# Altium project FoxSky.Tractor2000.PrjPcb
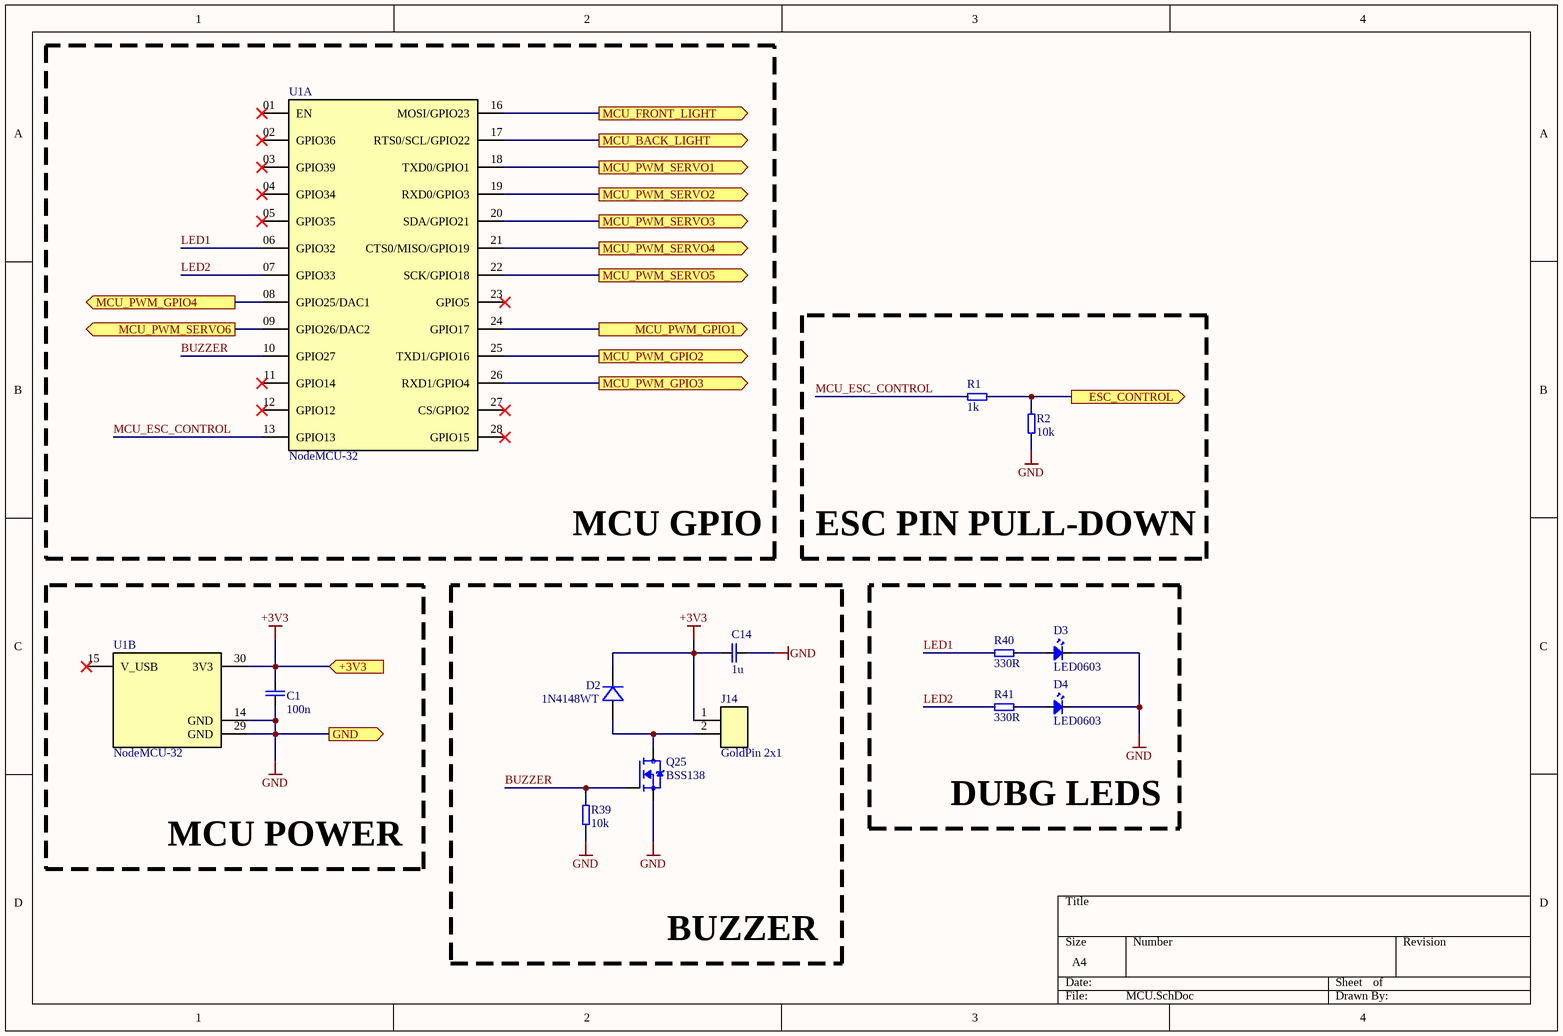
[diagram p0: MCU.SchDoc]
2 sheets, 73 parts. Net scope: flat (ports and power ports of the same name join across sheets).
Board file: FoxSky.TractorVCU.PcbDoc
Sheets:
  MCU.SchDoc
  LOAD_SWITCHES.SchDoc

## Sheet MCU.SchDoc
size A4; SheetNumber: 2; SheetTotal: 4

### Parts
C1  100n  [C0402]
C14  1u  [C0603]
D2  1N4148WT  [SMBJSeries_LTF]
D3  LED0603  [LED0603]
D4  LED0603  [LED0603]
J14  GoldPin 2x1  [HARWIN_M20-9990246]
Q25  BSS138  [SOT95P240X111-3N]
R1  1k  [R0402]
R2  10k  [R0402]
R39  10k  [R0603]
R40  330R  [R0603]
R41  330R  [R0603]
U1  NodeMCU-32  [NodeMCU-32]  (parts A,B of 2)

### Blocks framed on the sheet
MCU GPIO: U1
ESC PIN PULL-DOWN: R1 R2
MCU POWER: C1 U1
BUZZER: C14 D2 J14 Q25 R39
DUBG LEDS: D3 D4 R40 R41

### Ports
+3V3 (in, see Tractor2000[4B], POWER[4A]), ESC_CONTROL (out, see Tractor2000[4C]), GND (out, see Tractor2000[4C], LOAD_SWITCHES[2A], POWER[1A]), MCU_BACK_LIGHT (out, see Tractor2000[4B], LOAD_SWITCHES[1B]), MCU_FRONT_LIGHT (out, see Tractor2000[4B], LOAD_SWITCHES[1A]), MCU_PWM_GPIO1 (out, see Tractor2000[4B], LOAD_SWITCHES[3A]), MCU_PWM_GPIO2 (out, see Tractor2000[4B], LOAD_SWITCHES[3B]), MCU_PWM_GPIO3 (out, see Tractor2000[4B], LOAD_SWITCHES[5A]), MCU_PWM_GPIO4 (out, see Tractor2000[4B], LOAD_SWITCHES[5B]), MCU_PWM_SERVO1 (out, see Tractor2000[4B], LOAD_SWITCHES[1C]), MCU_PWM_SERVO2 (out, see Tractor2000[4B], LOAD_SWITCHES[1D]), MCU_PWM_SERVO3 (out, see Tractor2000[4B], LOAD_SWITCHES[3C]), MCU_PWM_SERVO4 (out, see Tractor2000[4B], LOAD_SWITCHES[3D]), MCU_PWM_SERVO5 (out, see Tractor2000[4B], LOAD_SWITCHES[5C]), MCU_PWM_SERVO6 (out, see Tractor2000[4B], LOAD_SWITCHES[5D])

### Nets
+3V3: C1.2 C14.2 D2.1 J14.1 U1.30(3V3) ; port +3V3
GND: C1.1 C14.1 D3.K D4.K Q25.2(S) R2.1 R39.1 U1.14(GND) U1.29(GND) ; port GND
BUZZER: Q25.1(G) R39.2 U1.10(GPIO27)
LED1: R40.2 U1.06(GPIO32)
LED2: R41.2 U1.07(GPIO33)
MCU_ESC_CONTROL: R1.1 U1.13(GPIO13)
NetD2_2: D2.2 J14.2 Q25.3(D)
NetD3_A: D3.A R40.1
NetD4_A: D4.A R41.1
NetQ4_1: U1.16(MOSI/GPIO23) ; port MCU_FRONT_LIGHT
NetQ5_1: U1.24(GPIO17) ; port MCU_PWM_GPIO1
NetQ6_1: U1.26(RXD1/GPIO4) ; port MCU_PWM_GPIO3
NetQ10_1: U1.17(RTS0/SCL/GPIO22) ; port MCU_BACK_LIGHT
NetQ11_1: U1.25(TXD1/GPIO16) ; port MCU_PWM_GPIO2
NetQ12_1: U1.08(GPIO25/DAC1) ; port MCU_PWM_GPIO4
NetQ16_1: U1.18(TXD0/GPIO1) ; port MCU_PWM_SERVO1
NetQ17_1: U1.20(SDA/GPIO21) ; port MCU_PWM_SERVO3
NetQ18_1: U1.22(SCK/GPIO18) ; port MCU_PWM_SERVO5
NetQ22_1: U1.19(RXD0/GPIO3) ; port MCU_PWM_SERVO2
NetQ23_1: U1.21(CTS0/MISO/GPIO19) ; port MCU_PWM_SERVO4
NetQ24_1: U1.09(GPIO26/DAC2) ; port MCU_PWM_SERVO6
NetR1_2: R1.2 R2.2 ; port ESC_CONTROL

Not connected (* = marked no-connect by the designer): U1 01(EN)* 02(GPIO36)* 03(GPIO39)* 04(GPIO34)* 05(GPIO35)* 11(GPIO14)* 12(GPIO12)* 15(V_USB)* 23(GPIO5)* 27(CS/GPIO2)* 28(GPIO15)*

### Library data of the parts
C1 = CMP-00023-15: Generic SMD 0402 Ceramic Capacitor
C14 = CMP-00024-8: Generic 0603 SMD Ceramic Capacitor
D2 = 1N4148WT: Description; Manufacturer_Name: Littelfuse Inc; Manufacturer_Part_Number: SMBJ7.0A; Copyright: Copyright (C) 2025 Ultra Librarian. All rights reserved.
D3 D4 = CMP-00036-7: 0603 LED
J14 = GoldPin 2x1: 2.54mm (0.1) Pitch SIL Vertical Throughboard Pin Header, 6.1mm mating pin height, tin, 2 contacts; MF: Harwin; MP: M20-9990246; SnapEDA_Link: https://www.snapeda.com/parts/M20-9990246/Harwin/view-part/?ref=snap; Package: None; Value: *; Check_prices: https://www.snapeda.com/parts/M20-9990246/Harwin/view-part/?ref=eda
Q25 = BSS138: N-Channel 50 V 220mA (Ta) 350mW (Ta) Surface Mount SOT-23-3; MF: onsemi; SnapEDA_Link: https://www.snapeda.com/parts/BSS138/Onsemi/view-part/?ref=snap; Package: SOT-23-3 ON Semiconductor; Value: *; MP: BSS138; Check_prices: https://www.snapeda.com/parts/BSS138/Onsemi/view-part/?ref=eda
R1 R2 = CMP-00016-11: Generic 0402 SMD Resistor
R39-R41 = CMP-00017-10: Generic 0603 SMD Resistor
U1 = NodeMCU-32: MF: Samtec Inc.; MP: TS-115-T-A; Package: None; Price: None; Value: *; Availability: Unavailable

## Sheet LOAD_SWITCHES.SchDoc
size A3; SheetNumber: 3; SheetTotal: 4
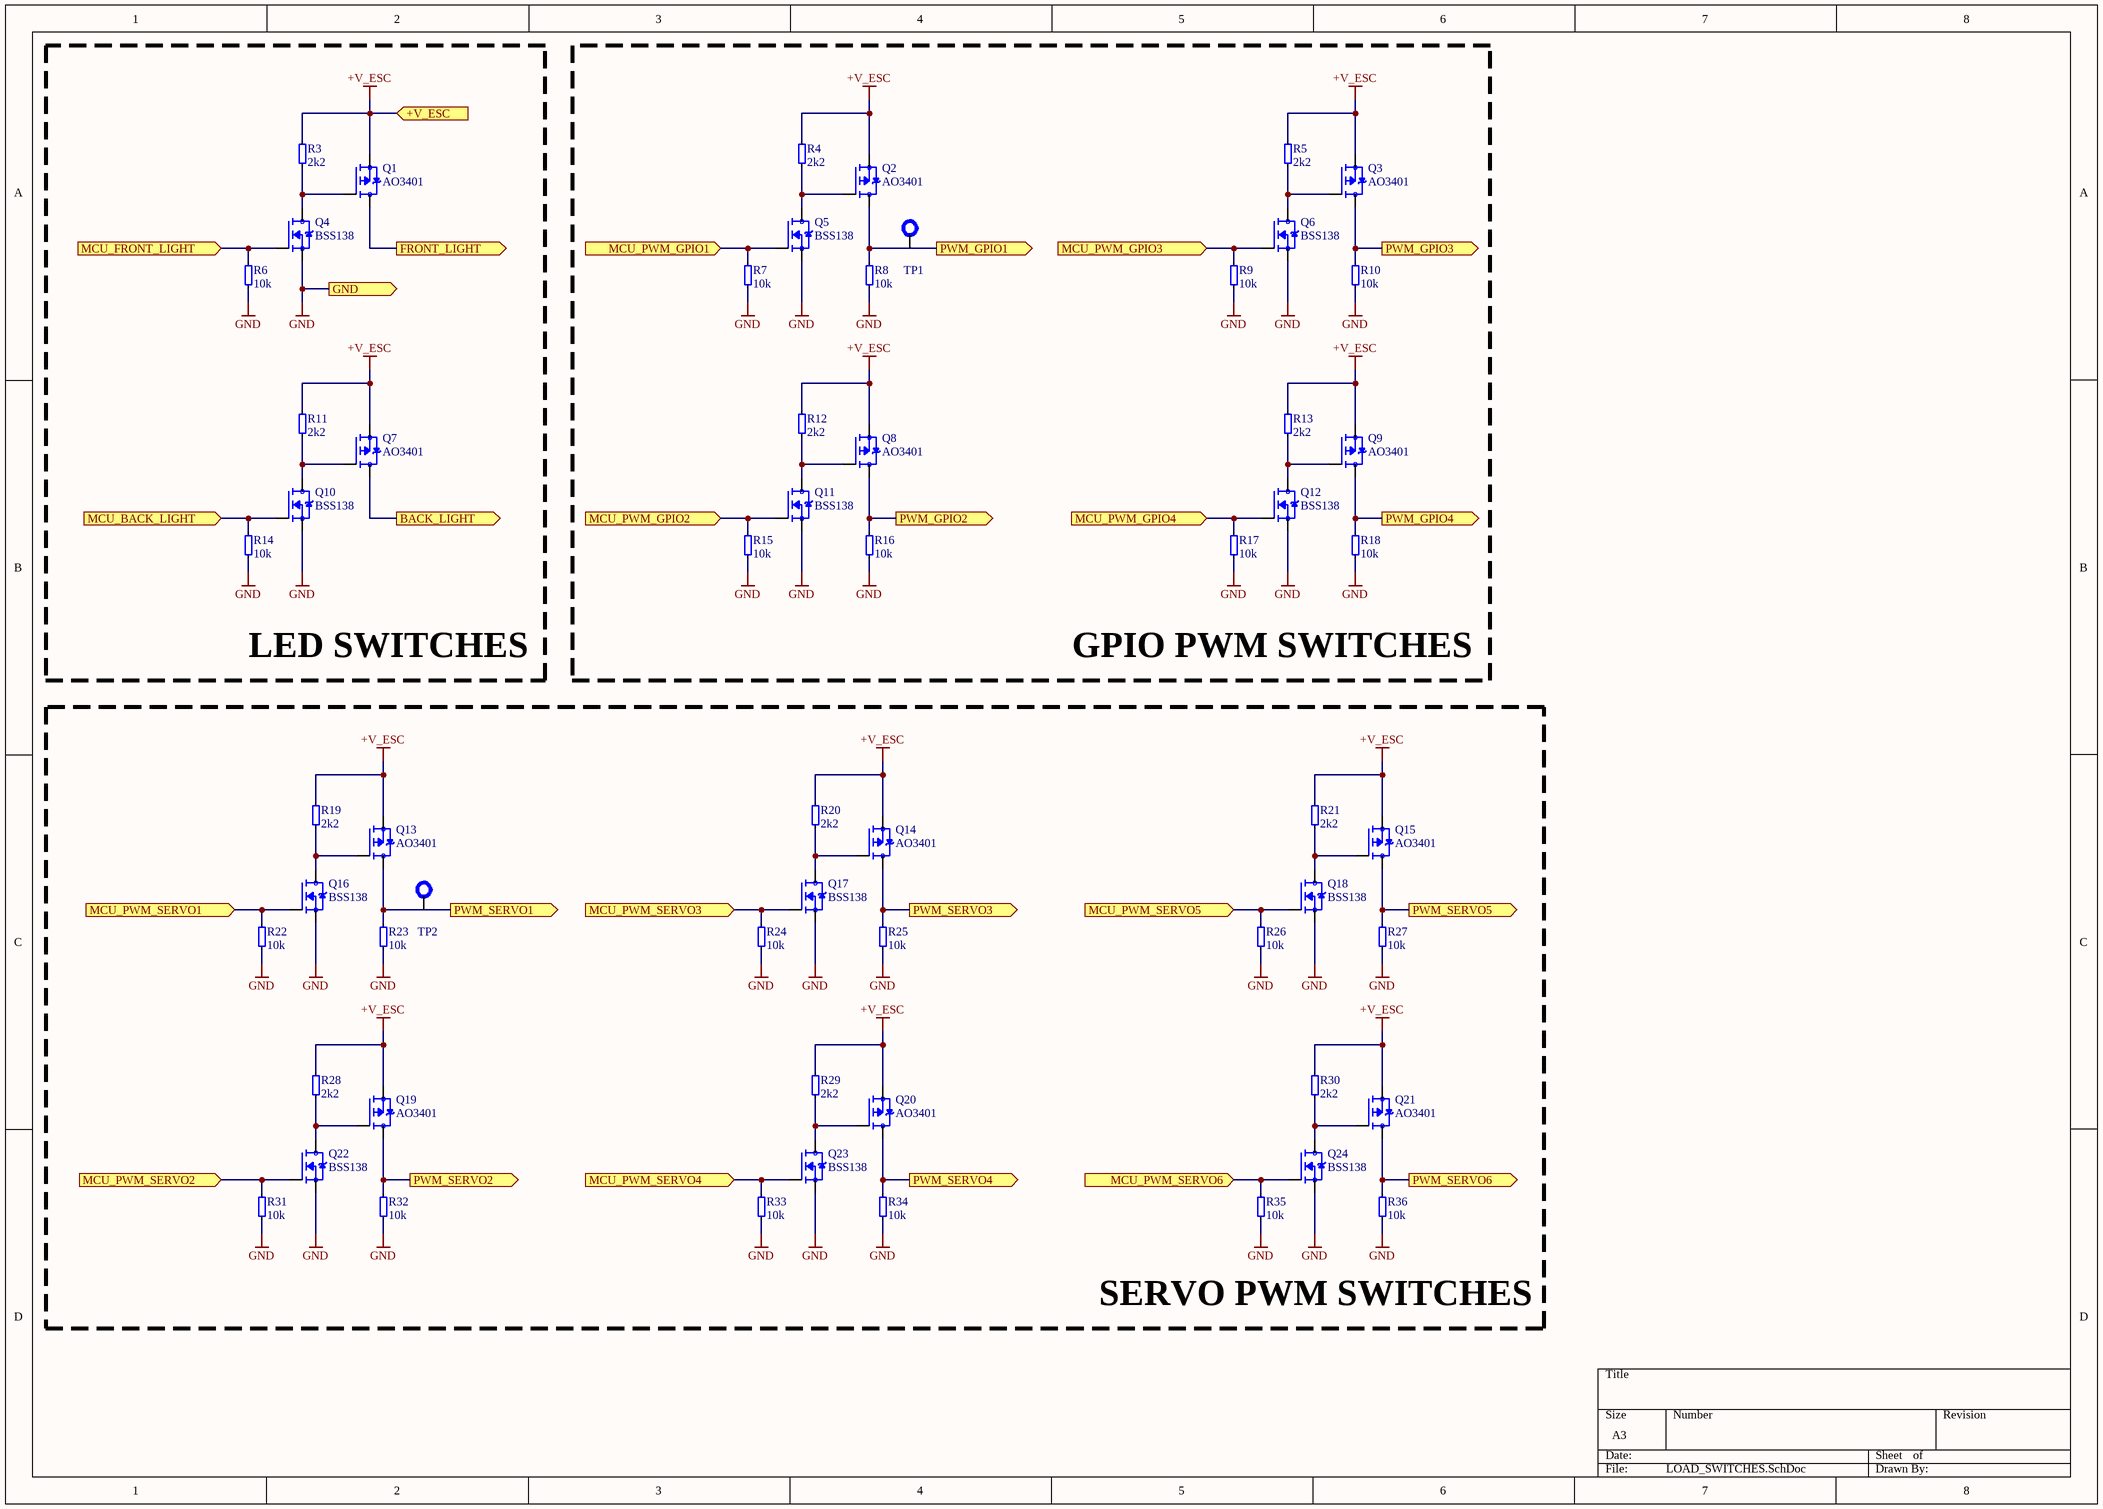
[diagram p1: LOAD_SWITCHES.SchDoc]

### Parts
Q1  AO3401  [SOT95P240X111-3N]
Q2  AO3401  [SOT95P240X111-3N]
Q3  AO3401  [SOT95P240X111-3N]
Q4  BSS138  [SOT95P240X111-3N]
Q5  BSS138  [SOT95P240X111-3N]
Q6  BSS138  [SOT95P240X111-3N]
Q7  AO3401  [SOT95P240X111-3N]
Q8  AO3401  [SOT95P240X111-3N]
Q9  AO3401  [SOT95P240X111-3N]
Q10  BSS138  [SOT95P240X111-3N]
Q11  BSS138  [SOT95P240X111-3N]
Q12  BSS138  [SOT95P240X111-3N]
Q13  AO3401  [SOT95P240X111-3N]
Q14  AO3401  [SOT95P240X111-3N]
Q15  AO3401  [SOT95P240X111-3N]
Q16  BSS138  [SOT95P240X111-3N]
Q17  BSS138  [SOT95P240X111-3N]
Q18  BSS138  [SOT95P240X111-3N]
Q19  AO3401  [SOT95P240X111-3N]
Q20  AO3401  [SOT95P240X111-3N]
Q21  AO3401  [SOT95P240X111-3N]
Q22  BSS138  [SOT95P240X111-3N]
Q23  BSS138  [SOT95P240X111-3N]
Q24  BSS138  [SOT95P240X111-3N]
R3  2k2  [R0402]
R4  2k2  [R0402]
R5  2k2  [R0402]
R6  10k  [R0402]
R7  10k  [R0402]
R8  10k  [R0402]
R9  10k  [R0402]
R10  10k  [R0402]
R11  2k2  [R0402]
R12  2k2  [R0402]
R13  2k2  [R0402]
R14  10k  [R0402]
R15  10k  [R0402]
R16  10k  [R0402]
R17  10k  [R0402]
R18  10k  [R0402]
R19  2k2  [R0402]
R20  2k2  [R0402]
R21  2k2  [R0402]
R22  10k  [R0402]
R23  10k  [R0402]
R24  10k  [R0402]
R25  10k  [R0402]
R26  10k  [R0402]
R27  10k  [R0402]
R28  2k2  [R0402]
R29  2k2  [R0402]
R30  2k2  [R0402]
R31  10k  [R0402]
R32  10k  [R0402]
R33  10k  [R0402]
R34  10k  [R0402]
R35  10k  [R0402]
R36  10k  [R0402]
TP1  TP  [TP]  (value not drawn)  (no BOM)
TP2  TP  [TP]  (value not drawn)  (no BOM)

### Blocks framed on the sheet
LED SWITCHES: Q1 Q4 Q7 Q10 R3 R6 R11 R14
GPIO PWM SWITCHES: Q2 Q3 Q5 Q6 Q8 Q9 Q11 Q12 R4 R5 R7-R10 R12 R13 R15-R18 TP1
SERVO PWM SWITCHES: Q13-Q24 R19-R36 TP2

### Ports
+V_ESC (in, see Tractor2000[6B], POWER[1A]), BACK_LIGHT (out, see Tractor2000[6B]), FRONT_LIGHT (out, see Tractor2000[6B]), GND (out, see Tractor2000[6C], MCU[1C], POWER[1A]), MCU_BACK_LIGHT (in, see Tractor2000[5B], MCU[2A]), MCU_FRONT_LIGHT (in, see Tractor2000[5B], MCU[2A]), MCU_PWM_GPIO1 (in, see Tractor2000[5B], MCU[2B]), MCU_PWM_GPIO2 (in, see Tractor2000[5B], MCU[2B]), MCU_PWM_GPIO3 (in, see Tractor2000[5B], MCU[2B]), MCU_PWM_GPIO4 (in, see Tractor2000[5B], MCU[1B]), MCU_PWM_SERVO1 (in, see Tractor2000[5B], MCU[2A]), MCU_PWM_SERVO2 (in, see Tractor2000[5B], MCU[2A]), MCU_PWM_SERVO3 (in, see Tractor2000[5B], MCU[2A]), MCU_PWM_SERVO4 (in, see Tractor2000[5B], MCU[2A]), MCU_PWM_SERVO5 (in, see Tractor2000[5B], MCU[2B]), MCU_PWM_SERVO6 (in, see Tractor2000[5B], MCU[1B]), PWM_GPIO1 (out, see Tractor2000[6B]), PWM_GPIO2 (out, see Tractor2000[6B]), PWM_GPIO3 (out, see Tractor2000[6B]), PWM_GPIO4 (out, see Tractor2000[6B]), PWM_SERVO1 (out, see Tractor2000[6B]), PWM_SERVO2 (out, see Tractor2000[6B]), PWM_SERVO3 (out, see Tractor2000[6B]), PWM_SERVO4 (out, see Tractor2000[6B]), PWM_SERVO5 (out, see Tractor2000[6B]), PWM_SERVO6 (out, see Tractor2000[6B])

### Nets
+V_ESC: Q1.3(D) Q2.3(D) Q3.3(D) Q7.3(D) Q8.3(D) Q9.3(D) Q13.3(D) Q14.3(D) Q15.3(D) Q19.3(D) Q20.3(D) Q21.3(D) R3.2 R4.2 R5.2 R11.2 R12.2 R13.2 R19.2 R20.2 R21.2 R28.2 R29.2 R30.2 ; port +V_ESC
GND: Q4.2(S) Q5.2(S) Q6.2(S) Q10.2(S) Q11.2(S) Q12.2(S) Q16.2(S) Q17.2(S) Q18.2(S) Q22.2(S) Q23.2(S) Q24.2(S) R6.1 R7.1 R8.1 R9.1 R10.1 R14.1 R15.1 R16.1 R17.1 R18.1 R22.1 R23.1 R24.1 R25.1 R26.1 R27.1 R31.1 R32.1 R33.1 R34.1 R35.1 R36.1 ; port GND
NetQ1_1: Q1.1(G) Q4.3(D) R3.1
NetQ1_2: Q1.2(S) ; port FRONT_LIGHT
NetQ2_1: Q2.1(G) Q5.3(D) R4.1
NetQ2_2: Q2.2(S) R8.2 ; port PWM_GPIO1
NetQ3_1: Q3.1(G) Q6.3(D) R5.1
NetQ3_2: Q3.2(S) R10.2 ; port PWM_GPIO3
NetQ4_1: Q4.1(G) R6.2 ; port MCU_FRONT_LIGHT
NetQ5_1: Q5.1(G) R7.2 ; port MCU_PWM_GPIO1
NetQ6_1: Q6.1(G) R9.2 ; port MCU_PWM_GPIO3
NetQ7_1: Q7.1(G) Q10.3(D) R11.1
NetQ7_2: Q7.2(S) ; port BACK_LIGHT
NetQ8_1: Q8.1(G) Q11.3(D) R12.1
NetQ8_2: Q8.2(S) R16.2 ; port PWM_GPIO2
NetQ9_1: Q9.1(G) Q12.3(D) R13.1
NetQ9_2: Q9.2(S) R18.2 ; port PWM_GPIO4
NetQ10_1: Q10.1(G) R14.2 ; port MCU_BACK_LIGHT
NetQ11_1: Q11.1(G) R15.2 ; port MCU_PWM_GPIO2
NetQ12_1: Q12.1(G) R17.2 ; port MCU_PWM_GPIO4
NetQ13_1: Q13.1(G) Q16.3(D) R19.1
NetQ13_2: Q13.2(S) R23.2 ; port PWM_SERVO1
NetQ14_1: Q14.1(G) Q17.3(D) R20.1
NetQ14_2: Q14.2(S) R25.2 ; port PWM_SERVO3
NetQ15_1: Q15.1(G) Q18.3(D) R21.1
NetQ15_2: Q15.2(S) R27.2 ; port PWM_SERVO5
NetQ16_1: Q16.1(G) R22.2 ; port MCU_PWM_SERVO1
NetQ17_1: Q17.1(G) R24.2 ; port MCU_PWM_SERVO3
NetQ18_1: Q18.1(G) R26.2 ; port MCU_PWM_SERVO5
NetQ19_1: Q19.1(G) Q22.3(D) R28.1
NetQ19_2: Q19.2(S) R32.2 ; port PWM_SERVO2
NetQ20_1: Q20.1(G) Q23.3(D) R29.1
NetQ20_2: Q20.2(S) R34.2 ; port PWM_SERVO4
NetQ21_1: Q21.1(G) Q24.3(D) R30.1
NetQ21_2: Q21.2(S) R36.2 ; port PWM_SERVO6
NetQ22_1: Q22.1(G) R31.2 ; port MCU_PWM_SERVO2
NetQ23_1: Q23.1(G) R33.2 ; port MCU_PWM_SERVO4
NetQ24_1: Q24.1(G) R35.2 ; port MCU_PWM_SERVO6

Not connected (* = marked no-connect by the designer): TP1 1; TP2 1

### Library data of the parts
Q1-Q3 Q7-Q9 Q13-Q15 Q19-Q21 = AO3401: P-Channel 30 V 4A Surface Mount SOT-23-3; MF: onsemi; MP: BSS138; SnapEDA_Link: https://www.snapeda.com/parts/BSS138/Onsemi/view-part/?ref=snap; Package: SOT-23-3 ON Semiconductor; Value: *; Check_prices: https://www.snapeda.com/parts/BSS138/Onsemi/view-part/?ref=eda
Q4-Q6 Q10-Q12 Q16-Q18 Q22-Q24 = BSS138: as Q25 on sheet MCU; SnapEDA_Link: https://www.snapeda.com/parts/BSS138/Onsemi/view-part/?ref=snap; Package: SOT-23-3 ON Semiconductor; Value: *; MP: BSS138; Check_prices: https://www.snapeda.com/parts/BSS138/Onsemi/view-part/?ref=eda
R3-R36 = CMP-00016-11: Generic 0402 SMD Resistor

## Nets that join several sheets
GND: MCU (9 pins), LOAD_SWITCHES (34 pins)
NetQ4_1: MCU (U1.16), LOAD_SWITCHES (Q4.1 R6.2)
NetQ5_1: MCU (U1.24), LOAD_SWITCHES (Q5.1 R7.2)
NetQ6_1: MCU (U1.26), LOAD_SWITCHES (Q6.1 R9.2)
NetQ10_1: MCU (U1.17), LOAD_SWITCHES (Q10.1 R14.2)
NetQ11_1: MCU (U1.25), LOAD_SWITCHES (Q11.1 R15.2)
NetQ12_1: MCU (U1.08), LOAD_SWITCHES (Q12.1 R17.2)
NetQ16_1: MCU (U1.18), LOAD_SWITCHES (Q16.1 R22.2)
NetQ17_1: MCU (U1.20), LOAD_SWITCHES (Q17.1 R24.2)
NetQ18_1: MCU (U1.22), LOAD_SWITCHES (Q18.1 R26.2)
NetQ22_1: MCU (U1.19), LOAD_SWITCHES (Q22.1 R31.2)
NetQ23_1: MCU (U1.21), LOAD_SWITCHES (Q23.1 R33.2)
NetQ24_1: MCU (U1.09), LOAD_SWITCHES (Q24.1 R35.2)